# Altium schematic sheet usb.SchDoc: MCB | USB
size A4; DocumentNumber: 6; SheetNumber: 6; SheetTotal: 12
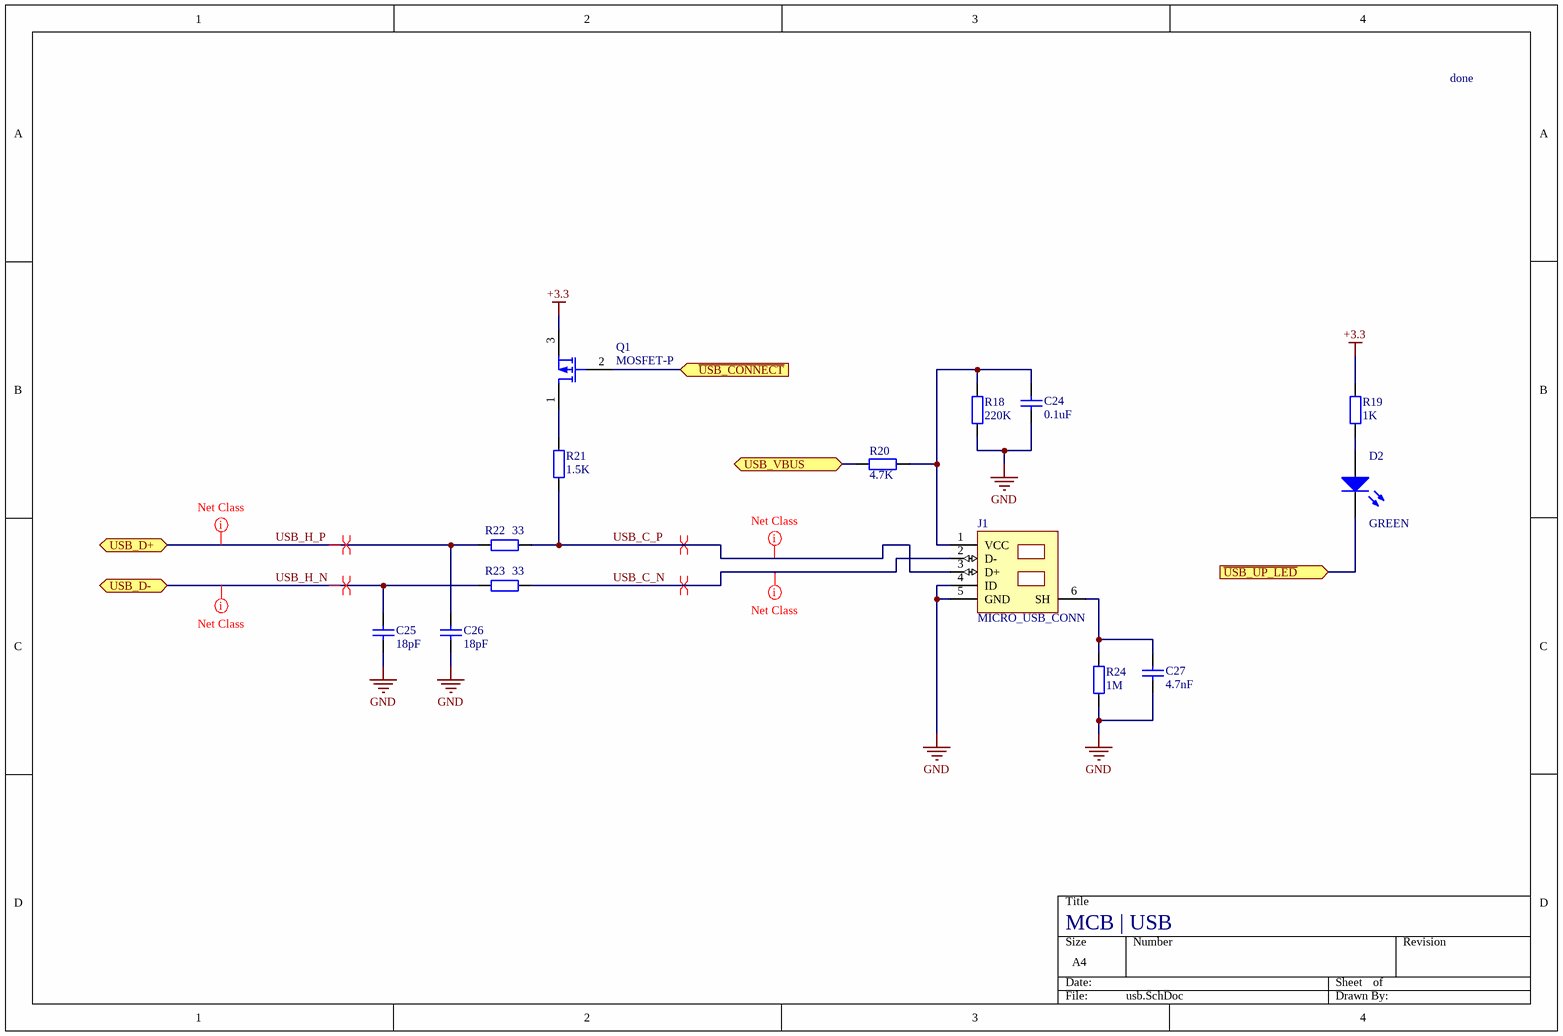
[diagram p0: usb.SchDoc]

## Parts
C24  value 0.1uF  [C0603]  (hidden comment: Cap)
C25  value 18pF  [C0603]  (hidden comment: Cap)
C26  value 18pF  [C0603]  (hidden comment: Cap)
C27  value 4.7nF  [C0603]  (hidden comment: Cap)
D2  value GREEN  [LGQ971]
J1  MICRO_USB_CONN  [USB_MICRO_CONNECTOR]
Q1  MOSFET-P  [BSH201,215]
R18  value 220K  [R0603]  (hidden comment: Res)
R19  value 1K  [R0603]  (hidden comment: Res)
R20  value 4.7K  [R0603]  (hidden comment: Res)
R21  value 1.5K  [R0603]  (hidden comment: Res)
R22  value 33  [R0603]  (hidden comment: Res)
R23  value 33  [R0603]  (hidden comment: Res)
R24  value 1M  [R0603]  (hidden comment: Res)

## Ports
USB_D+ (bidir), USB_D- (bidir), USB_VBUS, ~{USB_CONNECT} (in), ~{USB_UP_LED} (in)

## Nets
+3.3: Q1.3(S) R19.2
GND: C24.2 C25.2 C26.2 C27.2 J1.4(ID) J1.5(GND) R18.1 R24.1
~{USB_CONNECT}: Q1.2(G) ; port ~{USB_CONNECT}
~{USB_UP_LED}: D2.2(K) ; port ~{USB_UP_LED}
USB_C_N: J1.2(D-) R23.2
USB_C_P: J1.3(D+) R21.1 R22.2
USB_H_N: C25.1 R23.1 ; port USB_D-
USB_H_P: C26.1 R22.1 ; port USB_D+
USB_VBUS: R20.1 ; port USB_VBUS
NetC24_1: C24.1 J1.1(VCC) R18.2 R20.2
NetC27_1: C27.1 J1.6(SH) R24.2
NetD2_1: D2.1(A) R19.1
NetQ1_1: Q1.1(D) R21.2

## Layout directives
differential pair: USB_C_N, USB_C_P, USB_H_N, USB_H_P
net class Usb: USB_C_N, USB_C_P, USB_H_N, USB_H_P

## Notes on the sheet
- done

## Library data of the parts
C24-C27 = Cap: Capacitor
  C24: farnell: 1759122
  C25 C26: farnell: 1759056
  C27: farnell: 1759098
D2 = LED2: Typical RED, GREEN, YELLOW, AMBER GaAs LED; farnell: 1226372
J1 = MICRO_USB_CONN: MOLEX - 47346-0001 - RECEPTACLE, MICRO USB B, BOTTOM MOUNT; farnell: 1568026
Q1 = MOSFET-P: P-Channel MOSFET; farnell: 1758073
R18-R24 = Res2: Resistor
  R18: farnell: 9330836
  R19: farnell: 9330380
  R20: farnell: 9331247
  R21: farnell: 9330607
  R22 R23: farnell: 9331050
  R24: farnell: 9330410